# EAGLE design Daughter_Board (EAGLE 8.6.0)
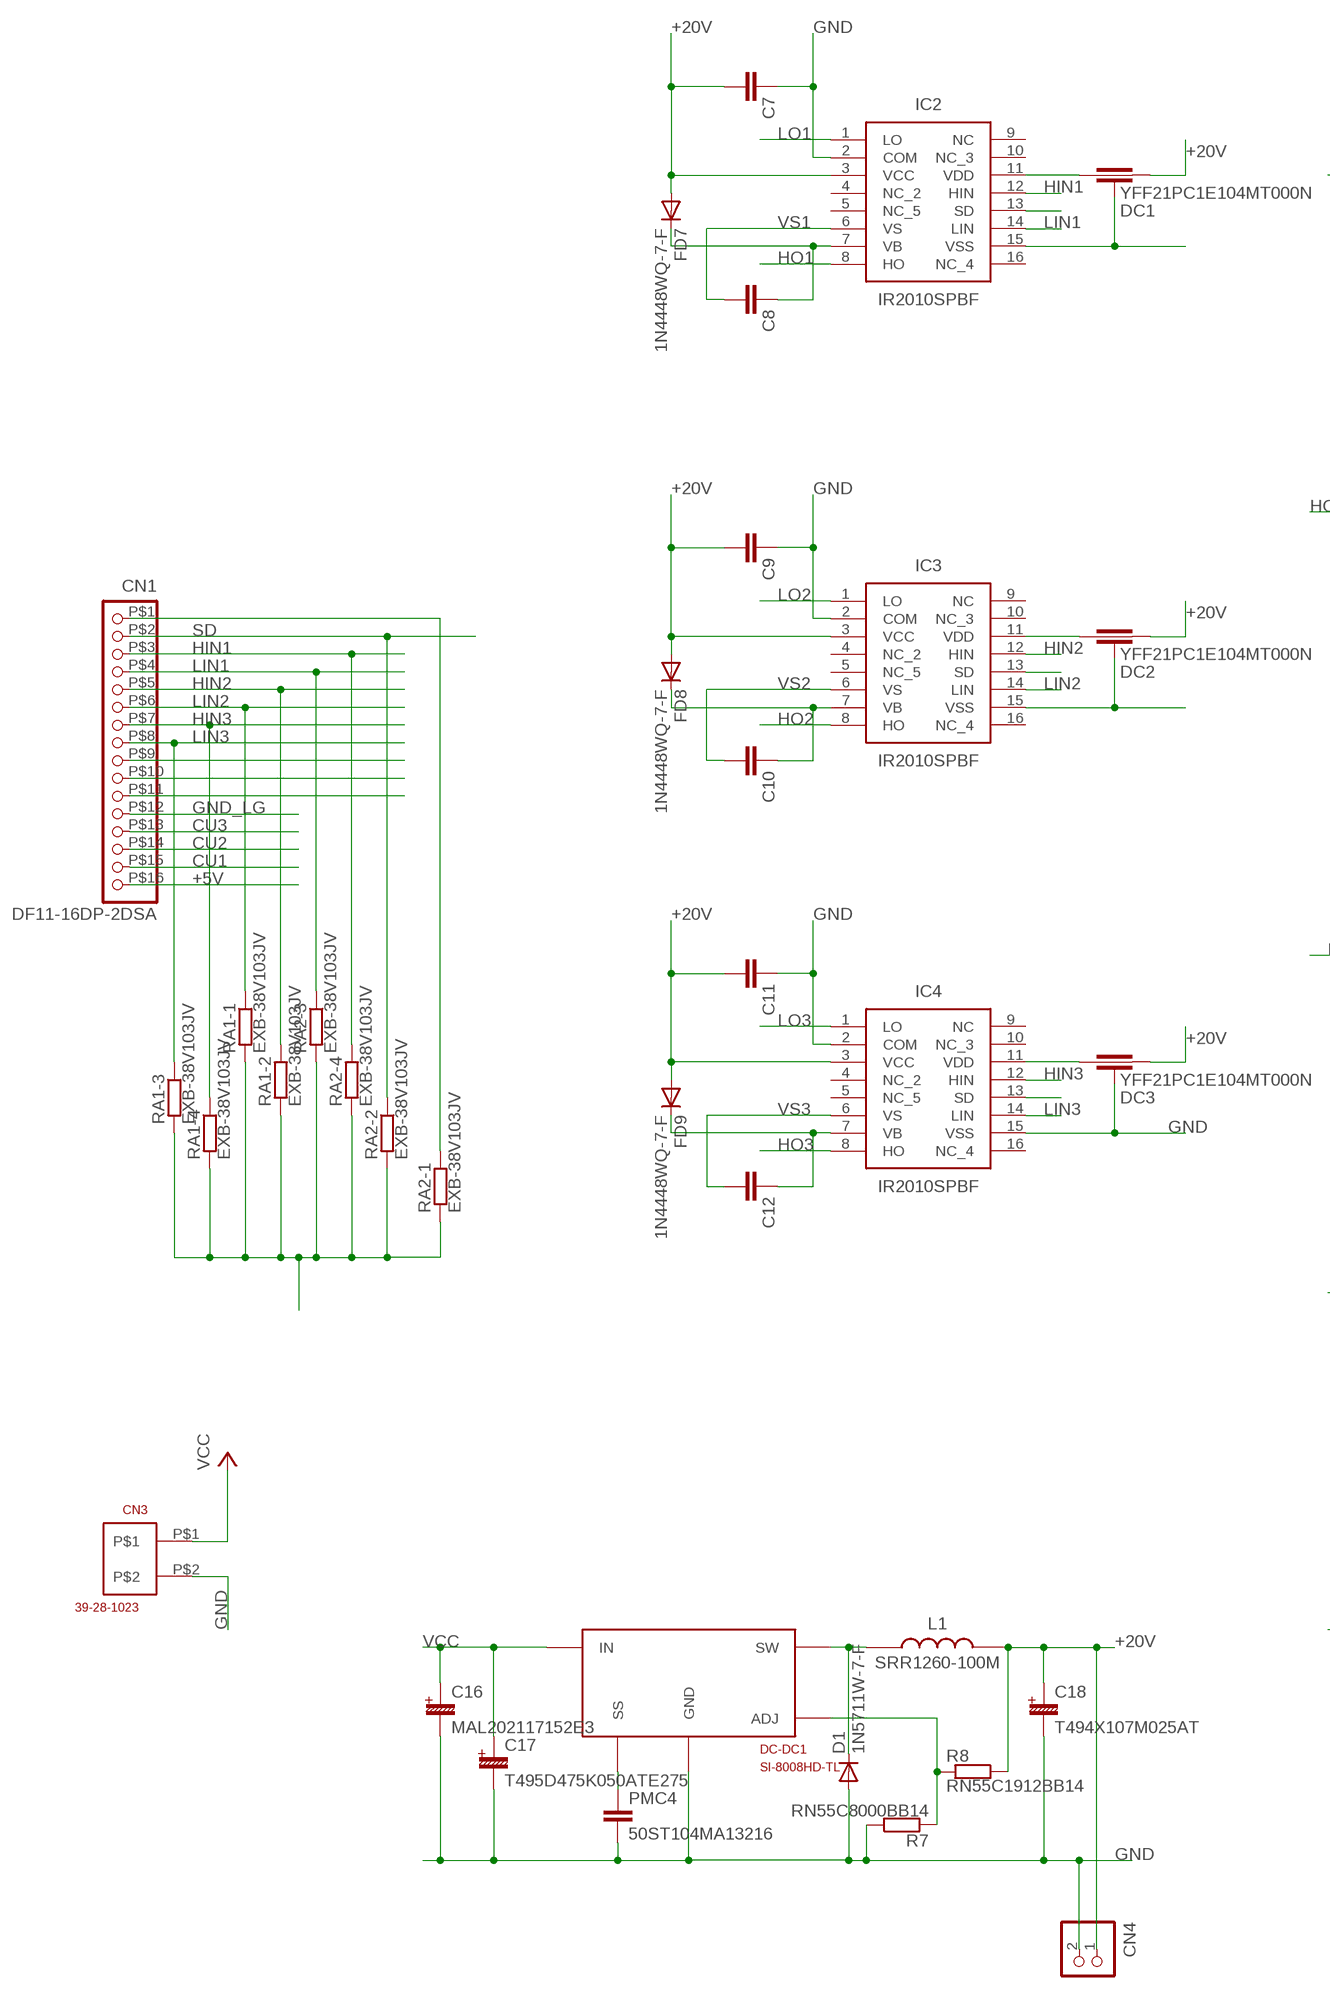
[diagram p0: schematic, sheet 1, part 1 of 3]
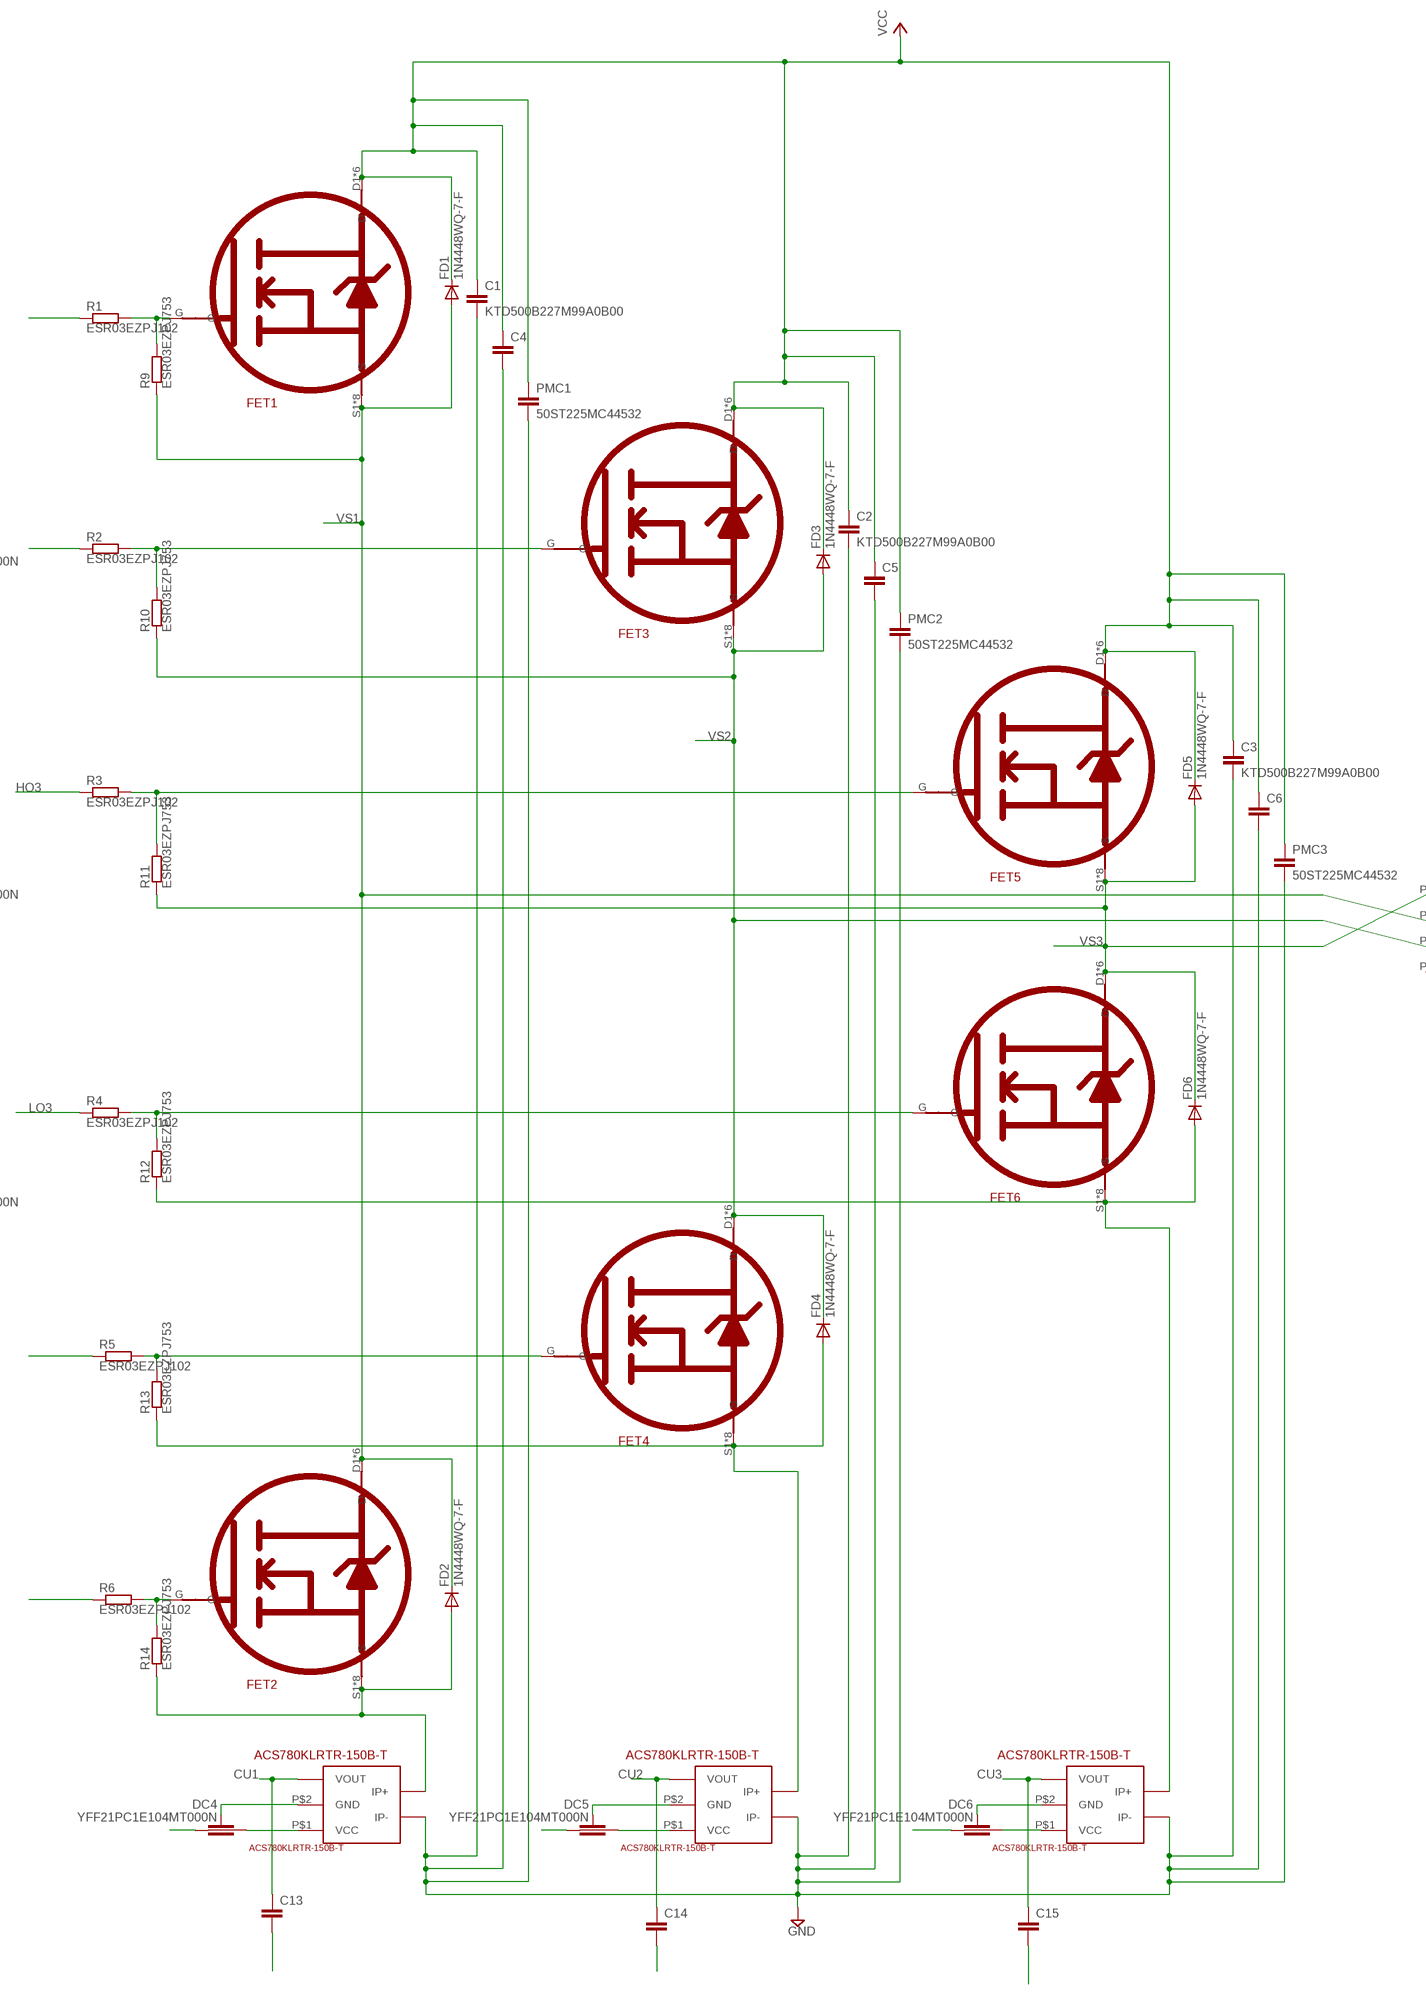
[diagram p1: schematic, sheet 1, part 2 of 3]
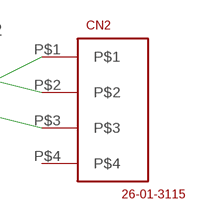
[diagram p2: schematic, sheet 1, part 3 of 3]

## Parts
C1  KTD500B227M99A0B00  [TKA50V_150U-220]
C2  KTD500B227M99A0B00  [TKA50V_150U-220]
C3  KTD500B227M99A0B00  [TKA50V_150U-220]
C4  CKG32KX7R1H105M335AJ  [CGK32K]
C5  CKG32KX7R1H105M335AJ  [CGK32K]
C6  CKG32KX7R1H105M335AJ  [CGK32K]
C7  C2012JB0J476M125AC  [C2012]
C8  C2012JB0J476M125AC  [C2012]
C9  C2012JB0J476M125AC  [C2012]
C10  C2012JB0J476M125AC  [C2012]
C11  C2012JB0J476M125AC  [C2012]
C12  C2012JB0J476M125AC  [C2012]
C13  CGA1A2C0G1E180J030BA  [CC0603]
C14  CGA1A2C0G1E180J030BA  [CC0603]
C15  CGA1A2C0G1E180J030BA  [CC0603]
C16  MAL202117152E3  [012AMS13*30]
C17  T495D475K050ATE275  [T495_D]
C18  T494X107M025AT  [T494_X]
CN1  DF11-16DP-2DSA  [DF11-16DP-2D]
CN2  26-01-3115  [26-01-3115]
CN3  39-28-1023  [39-28-1023]
CN4  B2B-XH-A  [B2B-XH-A]
D1  1N5711W-7-F  [SOD123]
DC1  YFF21PC1E104MT000N  [YFF21PC]
DC2  YFF21PC1E104MT000N  [YFF21PC]
DC3  YFF21PC1E104MT000N  [YFF21PC]
DC4  YFF21PC1E104MT000N  [YFF21PC]
DC5  YFF21PC1E104MT000N  [YFF21PC]
DC6  YFF21PC1E104MT000N  [YFF21PC]
DC-DC1  SI-8008HD-TL  [D2_PACAGE_5PIN]
FD1  1N4448WQ-7-F  [SOD123]
FD2  1N4448WQ-7-F  [SOD123]
FD3  1N4448WQ-7-F  [SOD123]
FD4  1N4448WQ-7-F  [SOD123]
FD5  1N4448WQ-7-F  [SOD123]
FD6  1N4448WQ-7-F  [SOD123]
FD7  1N4448WQ-7-F  [SOD123]
FD8  1N4448WQ-7-F  [SOD123]
FD9  1N4448WQ-7-F  [SOD123]
FET1  IRF7739L1TRPBF  [DIRECT_FET-L8]
FET2  IRF7739L1TRPBF  [DIRECT_FET-L8]
FET3  IRF7739L1TRPBF  [DIRECT_FET-L8]
FET4  IRF7739L1TRPBF  [DIRECT_FET-L8]
FET5  IRF7739L1TRPBF  [DIRECT_FET-L8]
FET6  IRF7739L1TRPBF  [DIRECT_FET-L8]
IC1  ACS780KLRTR-150B-T  [7-PIN_PSOP]
IC2  IR2010SPBF  [SOIC127P1032X265-16N]
IC3  IR2010SPBF  [SOIC127P1032X265-16N]
IC4  IR2010SPBF  [SOIC127P1032X265-16N]
IC5  ACS780KLRTR-150B-T  [7-PIN_PSOP]
IC6  ACS780KLRTR-150B-T  [7-PIN_PSOP]
L1  SRR1260-100M  [SRR1260]
PMC1  50ST225MC44532  [4532]
PMC2  50ST225MC44532  [4532]
PMC3  50ST225MC44532  [4532]
PMC4  50ST104MA13216  [3216]
R1  ESR03EZPJ102  [ESR03]
R2  ESR03EZPJ102  [ESR03]
R3  ESR03EZPJ102  [ESR03]
R4  ESR03EZPJ102  [ESR03]
R5  ESR03EZPJ102  [ESR03]
R6  ESR03EZPJ102  [ESR03]
R7  RN55C8000BB14  [CMF55]
R8  RN55C1912BB14  [CMF55]
R9  ESR03EZPJ753  [ESR03]
R10  ESR03EZPJ753  [ESR03]
R11  ESR03EZPJ753  [ESR03]
R12  ESR03EZPJ753  [ESR03]
R13  ESR03EZPJ753  [ESR03]
R14  ESR03EZPJ753  [ESR03]
RA1  EXB-38V103JV  [EXB-38V,28V]
RA2  EXB-38V103JV  [EXB-38V,28V]

## Nets
+5V: CN1.P$16 DC4.P$2 DC5.P$2 DC6.P$2
+20V: C7.P$2 C9.P$2 C11.P$2 C18.P$+(+) CN4.1 DC1.P$2 DC2.P$2 DC3.P$2 FD7.A FD8.A FD9.A IC2.3(VCC) IC3.3(VCC) IC4.3(VCC) L1.P$2 R8.P$1
CU1: C13.P$1 CN1.P$15 IC1.P$3(VOUT)
CU2: C14.P$1 CN1.P$14 IC5.P$3(VOUT)
CU3: C15.P$1 CN1.P$13 IC6.P$3(VOUT)
GND: C1.P$2 C2.P$2 C3.P$2 C4.P$2 C5.P$2 C6.P$2 C7.P$1 C9.P$1 C11.P$1 C16.P$2 C17.P$2 C18.P$2 CN3.P$2 CN4.2 D1.A DC1.GND1(GND) DC1.GND2(GND) DC2.GND1(GND) DC2.GND2(GND) DC3.GND1(GND) DC3.GND2(GND) DC-DC1.P$1(GND) DC-DC1.P$4(GND) IC1.P$6(IP-) IC2.2(COM) IC2.15(VSS) IC3.2(COM) IC3.15(VSS) IC4.2(COM) IC4.15(VSS) IC5.P$6(IP-) IC6.P$6(IP-) PMC1.P$2 PMC2.P$2 PMC3.P$2 PMC4.P$2 R7.P$1
GND_LG: C13.P$2 C14.P$2 C15.P$2 CN1.P$12 DC4.GND1(GND) DC4.GND2(GND) DC5.GND1(GND) DC5.GND2(GND) DC6.GND1(GND) DC6.GND2(GND) IC1.P$2(GND) IC5.P$2(GND) IC6.P$2(GND) RA1.P$5 RA1.P$6 RA1.P$7 RA1.P$8 RA2.P$5 RA2.P$6 RA2.P$7 RA2.P$8
HIN1: CN1.P$3 IC2.12(HIN) RA2.P$4
HIN2: CN1.P$5 IC3.12(HIN) RA1.P$2
HIN3: CN1.P$7 IC4.12(HIN) RA1.P$4
HO1: IC2.8(HO) R1.P$2
HO2: IC3.8(HO) R2.P$2
HO3: IC4.8(HO) R3.P$2
LIN1: CN1.P$4 IC2.14(LIN) RA2.P$3
LIN2: CN1.P$6 IC3.14(LIN) RA1.P$1
LIN3: CN1.P$8 IC4.14(LIN) RA1.P$3
LO1: IC2.1(LO) R6.P$2
LO2: IC3.1(LO) R5.P$2
LO3: IC4.1(LO) R4.P$2
N$1: CN1.P$1 RA2.P$1
N$3: FD2.A FET2.S1(S) FET2.S2(S) FET2.S3(S) FET2.S4(S) FET2.S5(S) FET2.S6(S) FET2.S7(S) FET2.S8(S) IC1.P$5(IP+) R14.P$2
N$5: FD4.A FET4.S1(S) FET4.S2(S) FET4.S3(S) FET4.S4(S) FET4.S5(S) FET4.S6(S) FET4.S7(S) FET4.S8(S) IC5.P$5(IP+) R13.P$2
N$7: DC4.P$1 IC1.P$1(VCC)
N$8: D1.K(C) DC-DC1.P$3(SW) L1.P$1
N$9: FET2.G R6.P$1 R14.P$1
N$10: DC5.P$1 IC5.P$1(VCC)
N$11: CN1.P$9
N$12: CN1.P$10
N$13: CN1.P$11
N$14: FET4.G R5.P$1 R13.P$1
N$15: FD6.A FET6.S1(S) FET6.S2(S) FET6.S3(S) FET6.S4(S) FET6.S5(S) FET6.S6(S) FET6.S7(S) FET6.S8(S) IC6.P$5(IP+) R12.P$2
N$16: DC6.P$1 IC6.P$1(VCC)
N$17: DC-DC1.P$5(ADJ) R7.P$2 R8.P$2
N$18: FET6.G R4.P$1 R12.P$1
N$19: FET5.G R3.P$1 R11.P$1
N$20: FET3.G R2.P$1 R10.P$1
N$21: FET1.G R1.P$1 R9.P$1
N$23: C8.P$1 FD7.K(C) IC2.7(VB)
N$25: C10.P$1 FD8.K(C) IC3.7(VB)
N$27: C12.P$1 FD9.K(C) IC4.7(VB)
N$28: DC2.P$1 IC3.11(VDD)
N$29: DC3.P$1 IC4.11(VDD)
N$30: DC1.P$1 IC2.11(VDD)
N$31: DC-DC1.P$6(SS) PMC4.P$1
SD: CN1.P$2 IC2.13(SD) IC3.13(SD) IC4.13(SD) RA2.P$2
VCC: C1.P$1 C2.P$1 C3.P$1 C4.P$1 C5.P$1 C6.P$1 C16.P$1(+) C17.P$1(+) CN3.P$1 DC-DC1.P$2(IN) FD1.K(C) FD3.K(C) FD5.K(C) FET1.D1(D) FET1.D2(D) FET1.D3(D) FET1.D4(D) FET1.D5(D) FET1.D6(D) FET3.D1(D) FET3.D2(D) FET3.D3(D) FET3.D4(D) FET3.D5(D) FET3.D6(D) FET5.D1(D) FET5.D2(D) FET5.D3(D) FET5.D4(D) FET5.D5(D) FET5.D6(D) PMC1.P$1 PMC2.P$1 PMC3.P$1
VS1: C8.P$2 CN2.P$2 FD1.A FD2.K(C) FET1.S1(S) FET1.S2(S) FET1.S3(S) FET1.S4(S) FET1.S5(S) FET1.S6(S) FET1.S7(S) FET1.S8(S) FET2.D1(D) FET2.D2(D) FET2.D3(D) FET2.D4(D) FET2.D5(D) FET2.D6(D) IC2.6(VS) R9.P$2
VS2: C10.P$2 CN2.P$3 FD3.A FD4.K(C) FET3.S1(S) FET3.S2(S) FET3.S3(S) FET3.S4(S) FET3.S5(S) FET3.S6(S) FET3.S7(S) FET3.S8(S) FET4.D1(D) FET4.D2(D) FET4.D3(D) FET4.D4(D) FET4.D5(D) FET4.D6(D) IC3.6(VS) R10.P$2
VS3: C12.P$2 CN2.P$1 FD5.A FD6.K(C) FET5.S1(S) FET5.S2(S) FET5.S3(S) FET5.S4(S) FET5.S5(S) FET5.S6(S) FET5.S7(S) FET5.S8(S) FET6.D1(D) FET6.D2(D) FET6.D3(D) FET6.D4(D) FET6.D5(D) FET6.D6(D) IC4.6(VS) R11.P$2
Unconnected: CN2.P$4 IC2.4(NC_2) IC2.5(NC_5) IC2.9(NC) IC2.10(NC_3) IC2.16(NC_4) IC3.4(NC_2) IC3.5(NC_5) IC3.9(NC) IC3.10(NC_3) IC3.16(NC_4) IC4.4(NC_2) IC4.5(NC_5) IC4.9(NC) IC4.10(NC_3) IC4.16(NC_4)

## Library data of the parts
C1-C3 = United_Chemi-con:KTD500B227M99A0B00
C4-C6 = TDK:CKG32KX7R1H105M335AJ: 1μ MLCC SMDリード付き
C7-C12 = TDK:C2012JB0J476M125AC: 47µF ±20% 6.3V セラミックコンデンサ JB 0805
C13-C15 = TDK:CGA1A2C0G1E180J030BA: 18pF ±5% 25V セラミックコンデンサ C0G、NP0 0201（0603メートル法）
C16 = VISHAY:MAL202117152E3: アルミ電解コンデンサ 1500µF 40V アキシャル、CAN 8000時間 @ 85°C 159ミリオーム
C17 = KEMET:T495D475K050ATE275: 4.7µF 成形 タンタルコンデンサ 50V 2917（7343メートル法）
C18 = KEMET:T494X107M025AT: 100µF 成形 タンタルコンデンサ 25V 2917（7343メートル法） 250ミリオーム
CN1 = Hirose:DF11-16DP-2DSA
CN2 = Molex:26-01-3115
CN3 = Molex:39-28-1023
CN4 = jst-xh:B2B-XH-A: Wire-to-Board 2.5mm pitch top mount connector Source: http://www.jst-mfg.com/product/pdf/jpn/XH.pdf http://www.jst-mfg.com/product/detail.php?series=277
D1 = DIODE:1N5711W-7-F: RF Diode Schottky - Single 70V 15mA 333mW SOD-123
DC1-DC6 = TDK:YFF21PC1E104MT000N: 0.1µF Feed Through Capacitor 25V 2A 80 mOhm 0805 (2012 Metric), 4 PC Pad
DC-DC1 = SANKEN:SI-8008HD-TL
FD1-FD9 = DIODE:1N4448WQ-7-F: ダイオード 標準 75V 250mA 面実装 SOD-123
FET1-FET6 = Infinion:IRF7739L1TRPBF
IC1 IC5 IC6 = ACS780:ACS780KLRTR-150B-T
IC2-IC4 = IR2010SPBF:IR2010SPBF: International Rectifier IR2010SPBF, Dual MOSFET Power Driver, 3A, 3.3 20 V, Non-Inverting, 16-Pin SOIC <http://uk.rs-online.com/largeimages/SOICW-16.jpg> Source: Datasheet; DESCRIPTION: International Rectifier IR2010SPBF, Dual MOSFET Power Driver, 3A, 3.3 20 V, Non-Inverting, 16-Pin SOIC; HEIGHT: mm; MANUFACTURER_NAME: International Rectifier; MANUFACTURER_PART_NUMBER: IR2010SPBF; RS_PART_NUMBER: 2509056226; SUPPLIER_NAME: RS
L1 = Bourns:SRR1260-100M: 10µH シールド付き 巻線 インダクタ 5.5A 20ミリオーム最大 非標準
PMC1-PMC3 = Rubycon:50ST225MC44532
PMC4 = Rubycon:50ST104MA13216: 0.1µF フィルムコンデンサ 50V アクリル、金属皮膜 1206（3216メートル法）
R1-R6 = ROHM:ESR03EZPJ102: 1 kOhms ±5% 0.25W、1/4W チップ抵抗 0603（1608メートル法） 車載用AEC-Q200、パルス耐性 厚膜
R7 = VISHAY:RN55C8000BB14: 金属被膜抵抗器 - スルーホール 1/10watt 800ohms .1% 50ppm
R8 = VISHAY:RN55C1912BB14: 金属被膜抵抗器 - スルーホール 1/10watt 19.1Kohms .1% 50ppm
R9-R14 = ROHM:ESR03EZPJ753: 75 kOhms ±5% 0.25W、1/4W チップ抵抗 0603（1608メートル法） 車載用AEC-Q200、パルス耐性 厚膜
RA1 RA2 = Pana_Chip_RA:EXB-38V103JV

## Board
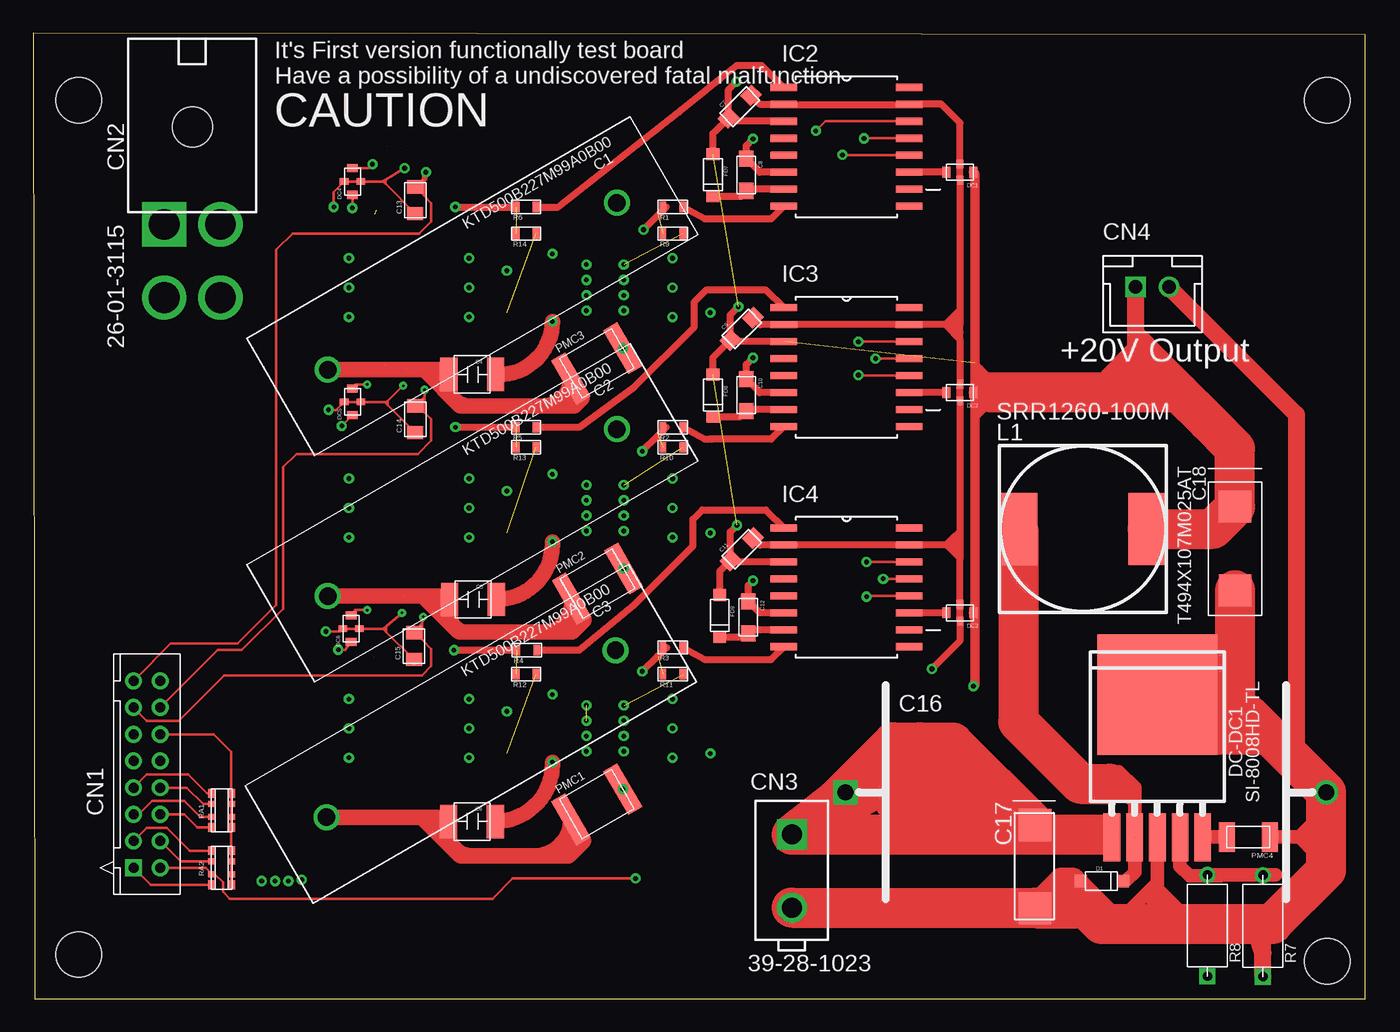
[diagram p3: board, top side]
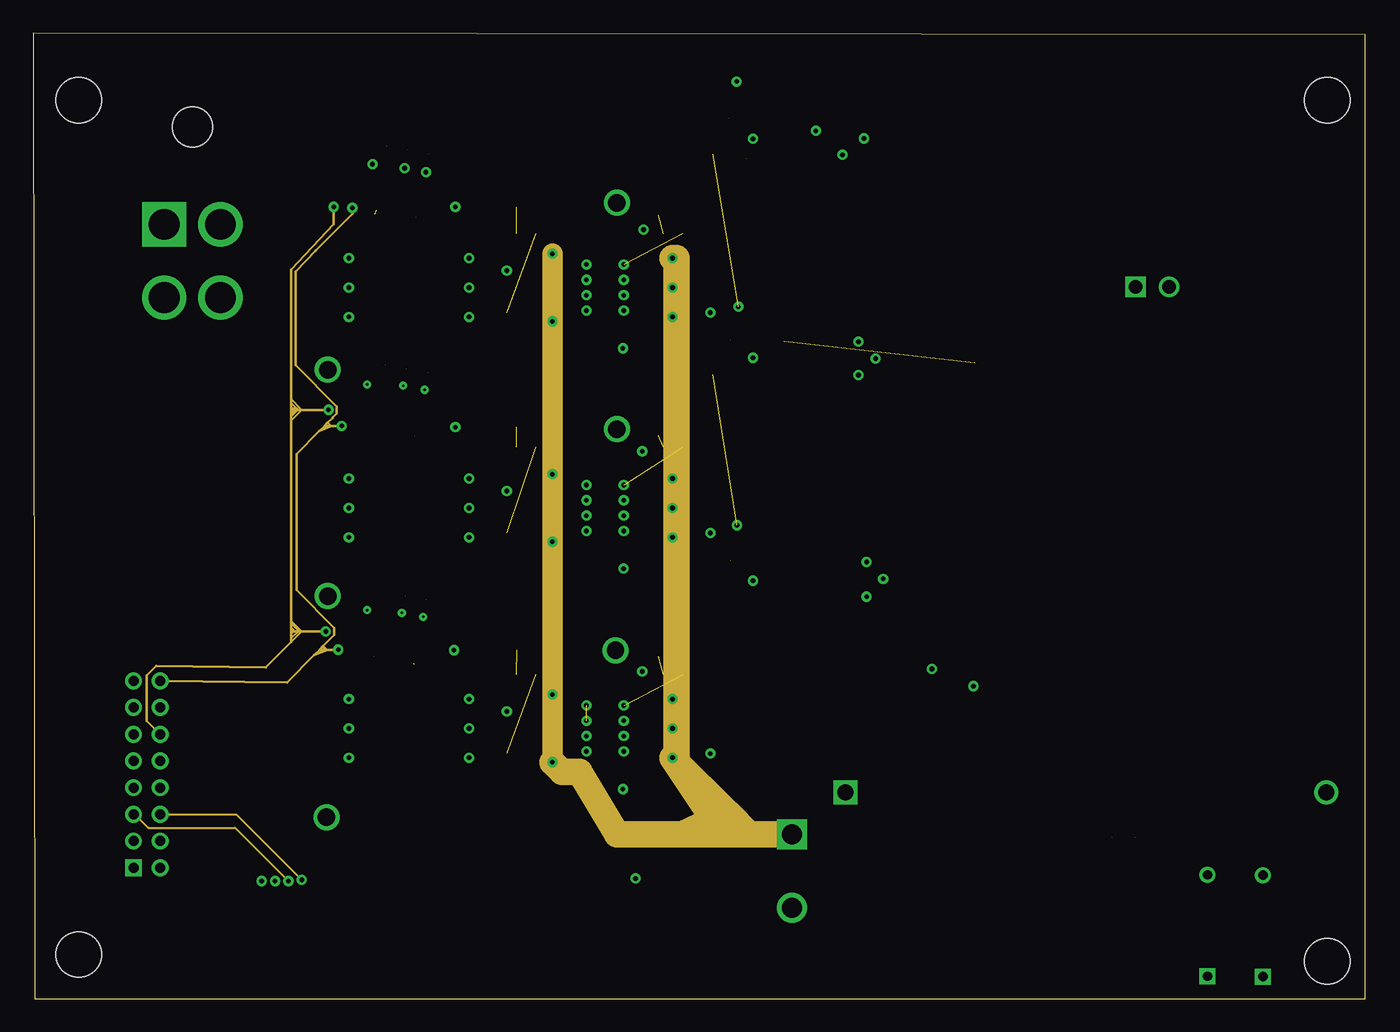
[diagram p4: board, inner layer Route2]
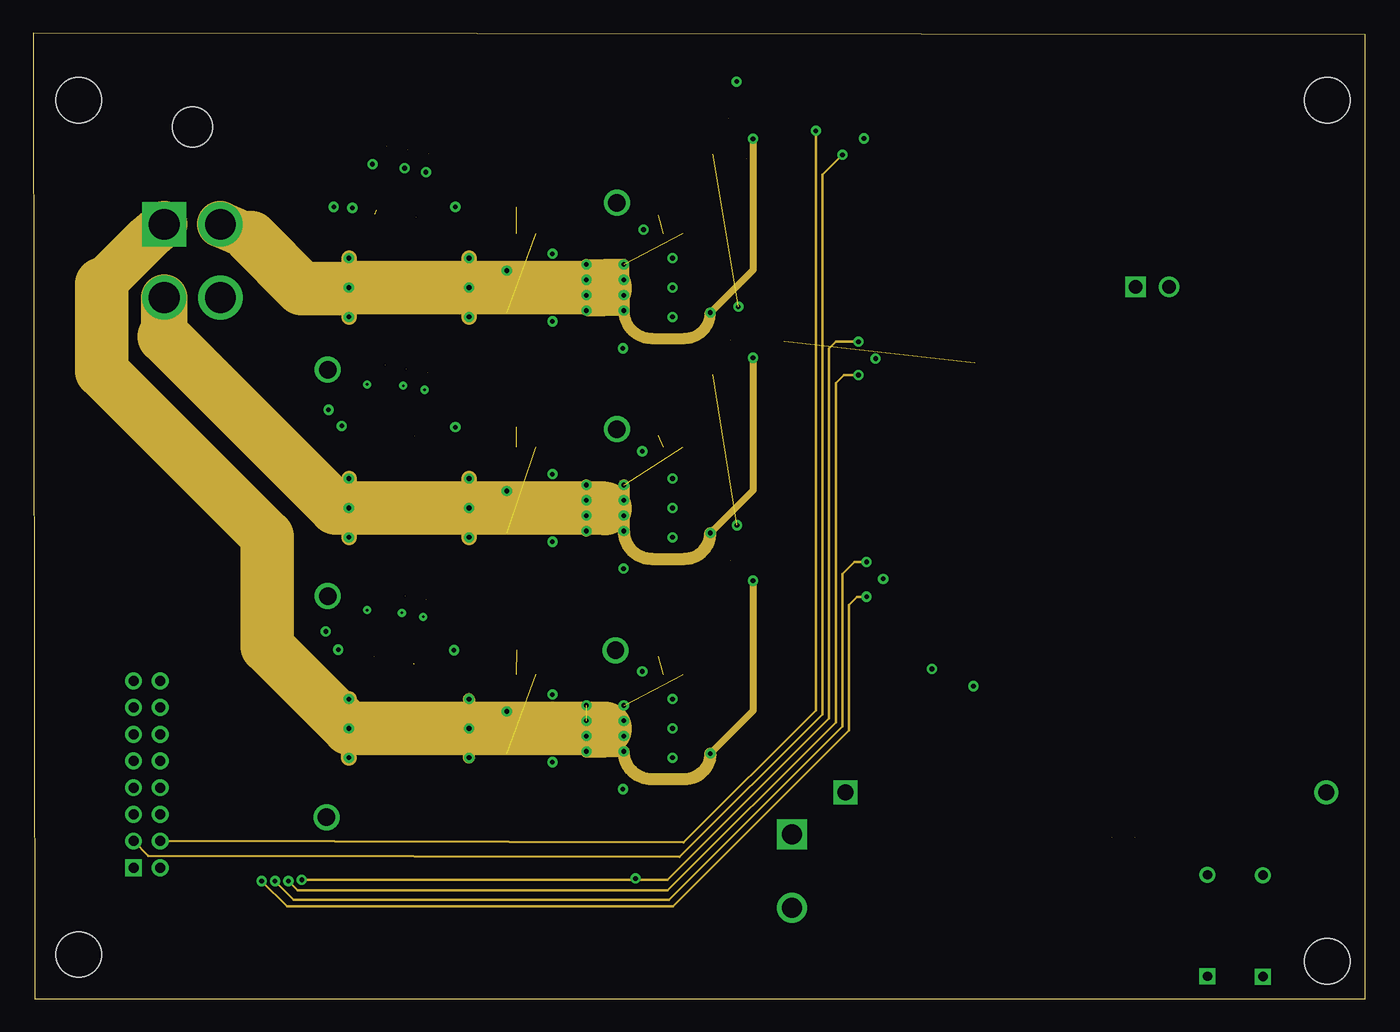
[diagram p5: board, inner layer Route3]
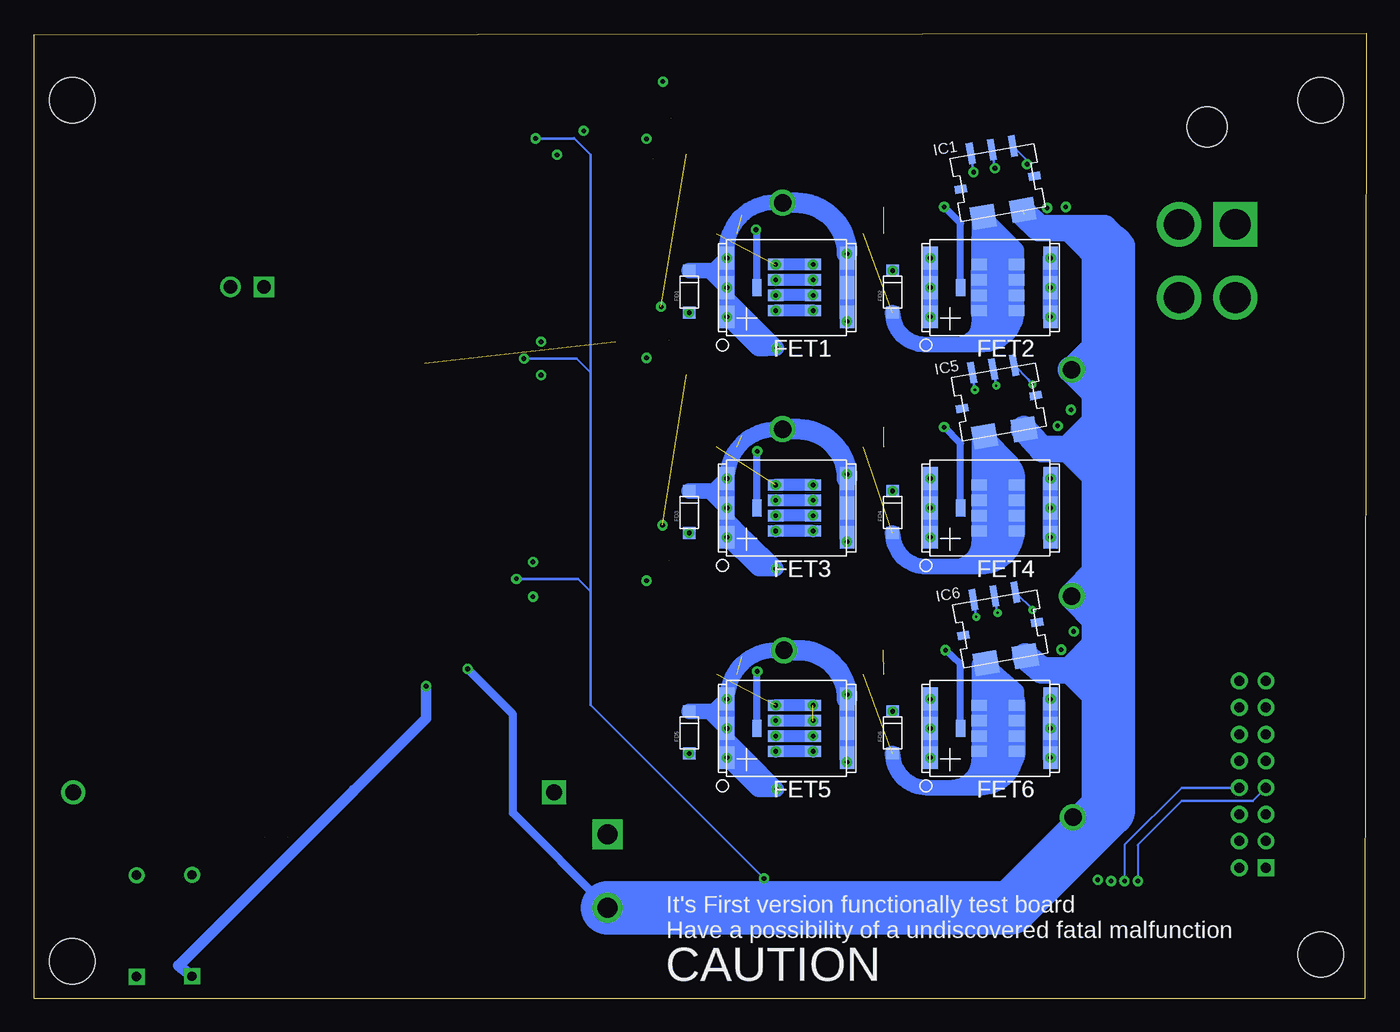
[diagram p6: board, bottom side, seen from below]

Size 99.75 x 72.3 mm. Coordinates in mm from the lower left corner, seen from the top.
Outline: 0.1,0 99.75,0 99.75,72.2 0,72.3 0.1,0
Copper layers (1*2+3*16): Top 0.035mm / dielectric 1.5mm / Route2 0.035mm / dielectric 0.15mm / Route3 0.035mm / dielectric 0.2mm / Bottom 0.035mm
Design rules "default *": minimum track width 6mil, minimum drill 0.35mm, track to track 6mil, track to pad 6mil, pad to pad 6mil, via to via 6mil, smd to smd 6mil, copper to edge 40mil, drill to drill 6mil, minimum pad ring 10mil, minimum via ring 8mil, stop-mask expansion 4mil, vias tented up to drill 0mil, thermal gap 10mil
Holes 3.4 mm at 3.4,3.3 3.4,67.3 96.9,67.3 96.9,2.8

### Footprints (pad centres in the part's own frame; a part is rotated, then mirrored left to right if it is on the bottom)
TKA50V_150U-220 = drill 1.3: P$1 0,0; P$2 25,0
CGK32K = smd 1.3 x 2.5: P$1 0,0; P$2 3.5,0
C2012 = smd 1.2 x 1.1: P$1 0,0; P$2 2.4,0
CC0603 = smd 1 x 1.2: P$1 0,0; P$2 2,0
012AMS13*30 = drill 1.2 square: P$1 0,0 | drill 1.2: P$2 36,0
T495_D = smd 2.37 x 2.43: P$1 0,0; P$2 6.24,0
T494_X = smd 2.37 x 2.43: P$2 3.12,0; P$+ -3.12,0
DF11-16DP-2D = drill 0.75 square: P$1 0,0 | drill 0.75: P$2 0,2; P$3 -2,0; P$4 -2,2; P$5 -4,0; P$6 -4,2; P$7 -6,0; P$8 -6,2; P$9 -8,0; P$10 -8,2; P$11 -10,0; P$12 -10,2; P$13 -12,0; P$14 -12,2; P$15 -14,0; P$16 -14,2
26-01-3115 = drill 2.3 square: P$1 2.1,0 | drill 2.3: P$2 -2.1,0; P$3 2.1,5.5; P$4 -2.1,5.5 | hole 3: 0,-7.3
39-28-1023 = drill 1.5 square: P$1 0,0 | drill 1.5: P$2 0,-5.5
B2B-XH-A = drill 1.016 square: 1 -1.25,0 | drill 1.016: 2 1.25,0
SOD123 = smd 0.9 x 0.95: A 3.15,0; K 0,0
YFF21PC = smd 0.5 x 0.65: GND1 0,0.625; GND2 0,-0.625 | smd 0.6 x 0.8: P$1 -1,0; P$2 1,0
D2_PACAGE_5PIN = smd 9 x 9: P$1 0,3 | smd 1.25 x 3.6: P$2 -3.4,-7.7; P$3 -1.7,-7.7; P$4 0,-7.7; P$5 1.7,-7.7; P$6 3.4,-7.7
DIRECT_FET-L8 = smd 1.1 x 1.7: D1 -2.25,2.2; D2 -2.25,0; D3 -2.25,-2.2; D4 6.75,-2.2; D5 6.75,0; D6 6.75,2.2 | smd 0.7 x 1.3: G 0,0 | smd 1.18 x 0.85: S1 1.4,1.725; S2 1.4,0.575; S3 1.4,-0.575; S4 1.4,-1.725; S5 4.2,1.725; S6 4.2,0.575; S7 4.2,-0.575; S8 4.2,-1.725
7-PIN_PSOP = smd 0.5 x 1.6: P$1 -1.6,-2.5; P$2 0,-2.5; P$3 1.6,-2.5 | smd 0.9 x 0.6: P$4 2.8,0; P$7 -2.8,0 | smd 1.8 x 1.7: P$5 1.5,2.35; P$6 -1.5,2.35
SOIC127P1032X265-16N = smd 1.981 x 0.533: 1 -4.699,4.445; 2 -4.699,3.175; 3 -4.699,1.905; 4 -4.699,0.635; 5 -4.699,-0.635; 6 -4.699,-1.905; 7 -4.699,-3.175; 8 -4.699,-4.445; 9 4.699,-4.445; 10 4.699,-3.175; 11 4.699,-1.905; 12 4.699,-0.635; 13 4.699,0.635; 14 4.699,1.905; 15 4.699,3.175; 16 4.699,4.445
SRR1260 = smd 2.9 x 5.4: P$1 -4.85,0; P$2 4.85,0
4532 = smd 1.2 x 3.8: P$1 0,0; P$2 4.5,0
3216 = smd 1.2 x 2.2: P$1 0,0; P$2 3.2,0
ESR03 = smd 0.5 x 0.8: P$1 -0.75,0; P$2 0.75,0
CMF55 = drill 0.7 square: P$1 -3.8,0 | drill 0.7: P$2 3.8,0
EXB-38V,28V = smd 0.65 x 0.55: P$1 -1.275,0.725; P$4 1.275,0.725; P$5 1.275,-0.725; P$8 -1.275,-0.725 | smd 0.45 x 0.55: P$2 -0.475,0.725; P$3 0.475,0.725; P$6 0.475,-0.725; P$7 -0.475,-0.725

### Placement (x,y rotation side)
C1  43.7,59.61 210 top
C2  43.7,42.65 210 top
C3  43.6,26.09 210 top
C4  34.62,46.75 180 top
C5  34.67,29.9 180 top
C6  34.6,13.27 180 top
C7  53.75,67.65 225 top
C8  53.4,60.5 90 top
C9  53.9,51.01 225 top
C10  53.4,44.01 90 top
C11  53.9,34.51 225 top
C12  53.55,27.36 90 top
C13  28.6,60.8 270 top
C14  28.6,44.4 270 top
C15  28.5,27.4 270 top
C16  60.82,15.46 0 top
C17  75.03,13.02 270 top
C18  90,33.71 270 top
CN1  7.5,9.8 270 top
CN2  11.9,58 180 top
CN3  56.8,12.3 0 top
CN4  83.8,53.3 0 top
D1  81.6,8.8 180 top
DC1  69.4,61.9 0 top
DC2  69.4,45.4 0 top
DC3  69.4,28.9 0 top
DC4  23.9,61.2 270 top
DC5  23.9,44.7 270 top
DC6  23.8,27.7 270 top
DC-DC1  84.18,19.77 0 top
FD1  50.7,54.53 270 bottom
FD2  35.46,54.53 270 bottom
FD3  50.7,38.02 270 bottom
FD4  35.46,38.02 270 bottom
FD5  50.7,21.51 270 bottom
FD6  35.46,21.51 270 bottom
FD7  50.9,60.1 90 top
FD8  50.9,43.6 90 top
FD9  51.4,27.1 90 top
FET1  45.62,53.26 0 bottom
FET2  30.38,53.26 0 bottom
FET3  45.62,36.75 0 bottom
FET4  30.38,36.75 0 bottom
FET5  45.62,20.24 0 bottom
FET6  30.38,20.24 0 bottom
IC1  27.6,61.12 190 bottom
IC2  60.9,63.8 0 top
IC3  60.9,47.3 0 top
IC4  60.9,30.8 0 top
IC5  27.5,44.7 190 bottom
IC6  27.4,27.7 190 bottom
L1  78.61,35.18 0 top
PMC1  44.15,15.69 210 top
PMC2  44.2,32.21 210 top
PMC3  44.15,48.71 210 top
PMC4  89.4,12.1 0 top
R1  47.9,59.3 0 top
R2  47.9,42.8 0 top
R3  47.9,26.3 0 top
R4  36.95,26.1 0 top
R5  36.9,42.8 0 top
R6  36.9,59.3 0 top
R7  92.09,5.44 90 top
R8  87.94,5.47 90 top
R9  47.9,57.3 0 top
R10  47.9,41.3 0 top
R11  47.9,24.3 0 top
R12  36.9,24.3 0 top
R13  36.9,41.3 0 top
R14  36.9,57.3 0 top
RA1  14.1,14.1 90 top
RA2  14.1,9.8 90 top

### Tracks (layer width: path | path; a pad name or v marks a point on that pad's centre or on a via)
+5V  (via drill 0.35)
  Top 0.2: DC4.P$2 v23.89,59.23 | DC5.P$2 v23.1,42.9 | DC6.P$2 23.33,26.13 v22.83,26.13
  Route2 0.2: v23.89,59.23 23.89,58.79 21.13,56.03 19.65,54.46 19.65,47.44 22.73,44.36 22.73,43.84 22.4,43.51 22.4,43.5 22.05,43.15 | 22.05,43.15 21.8,42.9 | 21.8,42.9 21.4,42.5 | 21.4,42.5 19.7,40.8 19.7,30.59 22.53,27.76 22.53,27.24 21.7,26.4 | v23.1,42.9 22.3,42.9 | 22.3,42.9 21.8,42.9 | 22.3,42.9 22.05,43.15 | 22.3,42.9 21.4,42.5 | 21.7,26.4 21.42,26.13 | 21.42,26.13 21.05,25.75 | 21.05,25.75 18.99,23.7 CN1.P$16 | v22.83,26.13 22,26.13 | 22,26.13 21.8,26.13 | 21.8,26.13 21.42,26.13 | 21.8,26.13 21.7,26.4 | 22,26.13 21.05,25.75 | 22,26.13 21.7,26.4
+20V  (via drill 0.35)  (6 unrouted)
  Top 0.508: 70.5,47.6 70.9,47.2 | 70.9,47.2 71.7,46.4 71.7,45.4 | 70.5,43.5 71.7,44.7 71.7,45.4 | 70.9,47.2 70.9,46.2 71.7,45.4 | IC3.3 52.31,49.2 C9.P$2 | FD8.A 50.9,48.01 C9.P$2 | IC4.3 52.31,32.7 C11.P$2 | C11.P$2 51.4,32.01 FD9.A | FD7.A 50.9,64.8 C7.P$2 | IC2.3 52.31,65.7 C7.P$2 | C9.P$2 52.2,51.22 v52.8,51.82 | C7.P$2 52.06,68.08 v52.67,68.69 | C11.P$2 52.2,34.96 v52.7,35.46
  Top 0.7: DC2.P$2 70.5,45.3 | 70.5,29 DC3.P$2 70.5,28.8 | 70.5,45.3 70.5,43.5 70.5,29 | v70.4,23.4 70.5,23.5 70.5,28.8 | 70.5,29 70.5,28.8 | DC1.P$2 70.5,61.8 70.5,47.6 70.5,45.3
  Top 1.27: CN4.1 82.55,49.85 | 82.55,49.85 83.45,48.95 | 83.45,48.95 84.05,48.35 | 84.05,48.35 87.2,45.2 87.2,43.1 88,42.3 88,43.2 87.95,43.25 | 85.8,45.4 84.05,47.15 84.05,48.35 | 83.3,45.4 83.3,48.8 83.45,48.95 | 82.55,49.85 82.55,48.7 | 82.55,48.7 82.55,46.95 | 82.55,46.95 82.55,46.25 82.4,46.1 | 82.55,48.7 79.9,46.05 79.9,46 | 81,45.4 82.55,46.95
  Top 3: 71.7,45.4 81,45.4 83.3,45.4 85.8,45.4 87.95,43.25 90,41.2 C18.P$+ 88.35,35.18 L1.P$2
  Bottom 0.8: 75.8,15.6 70.4,21 v70.4,23.4
  Bottom 0.813: R8.P$1 88.94,2.46 75.8,15.6
CU1  (via drill 0.35)  (1 unrouted)
  Top 0.15: 7.55,23.85 9,25.3 | 13.8,26.6 13.7,26.6
  Top 0.152: CN1.P$15 7.55,23.85 | 13.8,26.6 10.3,26.6
  Top 0.2: 29.25,60.15 C13.P$1 29.2,61.4 | 29.25,60.15 29.8,59.6 29.8,58.2 28.9,57.3 19.4,57.3 18.2,56.1 18.2,29.5 15.3,26.6 13.8,26.6 | 29.25,61.2 29.25,61.4 29.2,61.4 | 29.25,61.2 29.25,60.15 | 29.2,61.4 29.2,61.7 v29.4,61.9 29.4,61.35 29.25,61.2 | 13.7,26.6 10.3,26.6 7.55,23.85
  Bottom 0.2: 29.7,63.22 IC1.P$3 v29.4,61.9
CU2  (via drill 0.2 pad 0.55)  (1 unrouted)
  Top 0.2: v29.3,45.6 29.3,45.1 | 29.3,45.1 C14.P$1 | 29.3,45.1 29.3,43.9 29.8,43.4 29.8,41.8 28.8,40.8 19.7,40.8 18.7,39.8 18.7,29.2 15.6,26.1 13.8,26.1 CN1.P$14
  Bottom 0.2: 29.5,46.89 IC5.P$3 v29.3,45.6
CU3  (via drill 0.2)  (1 unrouted)
  Top 0.2: v29.2,28.6 29.1,28.1 | 29.1,28.1 C15.P$1 28.6,27.4 29.1,26.9 | 29.1,26.9 29.8,26.2 29.8,24.9 29.1,24.2 14.3,24.2 10.9,20.8 8.5,20.8 CN1.P$13 | 29.1,28.1 29.1,26.9
  Bottom 0.2: IC6.P$3 v29.2,28.6
GND  (via drill 0.35)  (2 unrouted)
  Top 0.508: 69.4,33 DC3.GND1 DC3.GND2 69.4,26.8 v67.3,24.7 | 69.4,33 68.7,33.7 | 68.7,33.7 68.4,34 | 68.4,34 68.38,33.97 | 68.38,33.97 IC4.15 IC4.2 54.43,33.97 C11.P$1 | 69.4,35 69.4,34.3 | 69.4,34.3 69.4,34 | 69.4,34 69.4,33.7 | 69.4,33.7 69.4,33 | 68.38,33.97 arc-90 68.4,34 | 68.4,34 69.4,34 | 69.4,33.7 68.7,33.7 | 68.4,34 68.85,34.45 | 68.85,34.45 69.4,35 | 69.4,34.3 69.25,34.45 68.85,34.45 | 69.4,49.38 69.4,49.9 | 69.4,49.9 69.4,50.5 | 68.9,50.47 69.38,50.47 69.4,50.5 | 68.9,50.47 68.3,50.47 | 69.4,51.57 DC1.GND2 DC1.GND1 69.4,65.6 68,67 65.62,67 IC2.15 IC2.2 54.43,66.97 C7.P$1 | 69.4,51.57 69.4,50.5 | 68.3,50.47 68.96,51.14 | 68.96,51.14 69.4,51.57 | 68.3,50.47 69.4,49.38 | 69.4,49.9 68.96,50.34 | 68.96,50.34 68.9,50.4 68.9,50.47 | 68.96,50.34 68.96,51.14 | 69.4,49.38 DC2.GND1 DC2.GND2 69.4,35 | 68.3,50.47 IC3.15 IC3.2 54.43,50.47 C9.P$1
  Top 0.8: 77.6,8 77.65,8 D1.A 78.43,8.82 77.02,8.82
  Top 1.016: 84.24,12 DC-DC1.P$4 84.18,8.68 | 83.35,7.85 82.3,6.8 | 84.7,5.6 84.7,6.5 84.18,7.02 | 84.18,7.02 83.35,7.85 | PMC4.P$2 94.8,12.1 | 94.8,12.1 96.82,12.1 | 94.8,12.1 96.1,10.8 | 94.8,12.1 96,13.3 | 84.18,8.68 84.18,7.02 | 83.35,7.85 83.95,8.45 | 83.95,8.45 84.18,8.68 | 83.95,8.45 85.9,6.5 86.4,6.5
  Top 1.143: 32.45,27.45 38.24,27.45 | 32.8,10.7 37.51,10.7 | 37.51,10.7 40.1,10.7 40.5,11.1 | PMC3.P$2 arc-90 38.19,44.4 | 38.19,44.4 32.5,44.4 | 32.5,44.4 arc-90 31.02,46.28 C4.P$2 arc90 30.56,47.11 29.3,47.11 | 29.3,47.11 C1.P$2 | 32.5,44.4 32.01,44.4 29.3,47.11 | 41.1,45 40.5,44.4 38.19,44.4 | C2.P$2 29.2,30.15 | 29.2,30.15 30.92,30.15 C5.P$2 | C5.P$2 31.12,29.23 | PMC2.P$2 40.3,29.51 arc-90 38.24,27.45 | 38.24,27.45 40.35,27.45 41.25,28.35 | 32.45,27.45 arc-90 31.17,28.73 C5.P$2 | 32.45,27.45 31.9,27.45 29.2,30.15 | 37.51,10.7 arc90 PMC1.P$2 40.25,11.35 40.5,11.1 | 40.5,11.1 41.2,11.8 | C3.P$2 29.1,13.59 | 29.1,13.59 30.78,13.59 C6.P$2 31.1,12.4 arc90 32.8,10.7 | 32.8,10.7 31.99,10.7 29.1,13.59
  Top 1.27: CN4.2 94.6,43.75 94.6,17.68 C16.P$2 | R7.P$1 92.09,3.4 | 92.09,3.4 92.09,5.31 92.8,5.6 | 92.09,3.4 91.59,4.9 91.4,4.9 91.4,5 90.8,5.6
  Top 2: 75.01,6.8 77.02,8.82 77.83,8.82 81.05,5.6 82.7,5.6
  Top 3: CN3.P$2 75.01,6.8 C17.P$2 78.82,6.78 80,5.6 82.7,5.6 84.7,5.6 90.8,5.6 92.8,5.6 96.82,9.62 96.82,12.1 C16.P$2 92.49,19.79 | 87.3,24.8 87.2,24.8 | 90,22.1 87.3,24.8 | 92.49,19.79 91.08,21.2 90.9,21.2 90,22.1 | C18.P$2 90,22.1 | 87.3,24.8 85.27,22.77 DC-DC1.P$1 87.16,19.79 92.49,19.79
  Bottom 0.61: CN3.P$2 63.9,13.9 63.9,21.3 v67.3,24.7
  Bottom 1.143: 19.3,44.3 19.75,44.3 22.9,41.15 22.85,41.15 20.1,38.4 | C3.P$2 19.81,13.59 arc-90 19.3,14.1 | C3.P$2 20.96,12.6 19.4,12.6 | C3.P$2 19.3,16.24 19.3,17.3
  Bottom 2: 19.3,55.7 19.3,56.08 20.92,57.7 | 19.3,49.8 21.99,47.11 C1.P$2 22.11,47.11 19.3,44.3 | 22.2,57.7 20.92,57.7 | 20.92,57.7 19.6,57.7 18.3,56.4 | 22.2,57.7 19.3,54.8 19.3,53.6 | 25.6,58.77 24.53,57.7 22.2,57.7 | C2.P$2 19.55,30.15 19.3,29.9 | C2.P$2 20,32.2 19.9,32.2 | C2.P$2 20,28.1 20,26.8 22.2,24.6 | IC5.P$6 24.3,41.15 22.9,41.15 19.3,41.15 | IC6.P$6 24.28,24.6 22.2,24.6 | 22.2,24.6 19.3,24.6 | 22.2,24.6 20.4,22.8 19.8,22.8
  Bottom 4: 19.3,56.08 19.3,53.6 19.3,49.8 19.3,44.3 19.3,41.15 19.3,29.9 19.3,24.6 19.3,17.3 19.3,14.1 26.6,6.8 CN3.P$2
GND_LG  (via drill 0.2, 0.35)  (3 unrouted)
  Top 0.2: v27.8,62.2 26.37,61.36 | 26.37,61.36 26.29,61.31 26.1,61.2 | 26.1,61.2 DC4.GND1 DC4.GND2 22.5,60.42 v22.5,59.3 | v22.1,44.1 22.67,44.1 DC5.GND2 DC5.GND1 26.3,44.7 | 26.2,27.7 DC6.GND1 DC6.GND2 22.97,27.5 v21.9,27.5 | 26.2,27.7 26.42,27.89 | 26.42,27.89 v27.6,28.9 | C15.P$2 26.42,27.48 | 26.42,27.48 26.2,27.7 | C14.P$2 26.55,44.45 | 26.55,44.45 26.3,44.7 | v27.7,45.91 26.55,44.75 | 26.55,44.75 26.49,44.7 26.3,44.7 | 26.55,44.75 26.55,44.45 | 26.42,27.89 26.42,27.48 | C13.P$2 26.37,61.03 | 26.37,61.03 26.2,61.2 26.1,61.2 | 26.37,61.03 26.37,61.36 | RA2.P$8 RA2.P$7 RA2.P$6 RA2.P$5 RA1.P$8 RA1.P$7 RA1.P$6 RA1.P$5 14.83,18.48 13.5,19.8 CN1.P$12
  Route2 0.2: v22.5,59.3 22.5,58 19.3,54.6 19.3,44.9 | 19.3,44.9 19.3,44.6 | 19.3,44.6 19.3,44.3 | 19.3,44.3 19.3,44.1 | 19.3,44.1 19.3,43.8 | 19.3,43.8 19.3,43.6 | 19.3,43.6 19.3,43.3 | 19.3,43.3 19.3,28.3 | 19.3,28.3 19.3,28.1 | 19.3,28.1 19.3,27.8 | 19.3,27.8 19.3,27.5 | 19.3,27.5 19.3,27.3 | 19.3,27.3 19.3,27 | 19.3,27 19.3,26.7 | v22.1,44.1 20.1,44.1 | 20.1,44.1 19.3,43.3 | 19.6,44.1 19.3,44.1 | 20.1,44.1 19.3,44.9 | 20.1,44.1 19.8,44.1 | 19.8,44.1 19.7,44.2 | 19.7,44.2 19.3,44.6 | 19.8,44.1 19.3,43.6 | 19.7,44.2 19.4,44.2 19.3,44.3 | 19.8,44.1 19.6,44.1 | 19.6,44.1 19.3,43.8 | v21.9,27.5 20.1,27.5 | 20.1,27.5 19.9,27.5 | 19.8,27.5 19.6,27.5 | 19.5,27.5 19.3,27.5 | 20.1,27.5 19.3,26.7 | 20.1,27.5 19.3,28.3 | 19.9,27.5 19.3,28.1 | 19.9,27.5 19.8,27.5 | 19.8,27.5 19.7,27.4 | 19.7,27.4 19.3,27 | 19.7,27.4 19.6,27.5 | 19.6,27.5 19.3,27.8 | 19.6,27.5 19.5,27.5 | 19.5,27.5 19.3,27.3 | 19.3,26.7 17.4,24.8 9.2,24.9 8.5,24.2 8.5,20.8 CN1.P$12
  Bottom 0.2: v27.7,45.91 27.93,47.04 IC5.P$2 | IC1.P$2 v27.8,62.2 | IC6.P$2 v27.6,28.9
HIN1  (via drill 0.35)
  Top 0.2: IC2.12 60.63,63.16 v60.6,63.2 | CN1.P$3 8.5,12.8 9.97,12.8 11.7,11.07 RA2.P$4
  Route3 0.2: v60.6,63.2 59.1,61.7 59.1,21.3 48.4,10.6 8.6,10.7 CN1.P$3
HIN2  (via drill 0.35)
  Top 0.2: IC3.12 61.84,46.66 v61.8,46.7 | CN1.P$5 7.9,13.8 8.9,14.8 11.3,14.8 12.47,13.62 RA1.P$2
  Route2 0.15: CN1.P$5 7.6,13.8 8.6,12.8 15.1,12.8 v19.1,8.8
  Route3 0.2: v61.8,46.7 60.7,46.7 60.1,46.1 60.1,20.7 47.5,8.1 19.8,8.1 v19.1,8.8
HIN3  (via drill 0.35)
  Top 0.2: IC4.12 62.46,30.17 v62.4,30.1 | CN1.P$7 8.5,16.8 11.6,16.8 13.03,15.38 RA1.P$4
  Route3 0.2: v62.4,30.1 61.7,30.1 61.1,29.5 61.1,20.1 47.9,6.9 19,6.9 v17.1,8.8
  Bottom 0.15: 13.8,14.8 17.1,11.5 v17.1,8.8
  Bottom 0.2: CN1.P$7 8.5,14.8 13.8,14.8
HO1
  Top 0.508: IC2.8 55.25,58.4 50.3,58.4 R1.P$2
HO2
  Top 0.508: IC3.8 55.25,41.9 50.8,41.9 50.6,41.9 50.3,41.9 R2.P$2
HO3
  Top 0.508: IC4.8 55.25,25.4 50.3,25.4 R3.P$2
LIN1  (via drill 0.35)
  Top 0.2: IC2.14 59.3,65.7 v58.6,65 | CN1.P$4 11.03,10.28 RA2.P$3
  Route3 0.2: v58.6,65 58.6,21.6 48.7,11.7 CN1.P$4
LIN2  (via drill 0.35)
  Top 0.2: IC3.14 v61.8,49.2 | CN1.P$6 11.3,13.8 12.28,12.82 RA1.P$1
  Route2 0.15: CN1.P$6 15.2,13.8 v20.1,8.9
  Route3 0.2: v61.8,49.2 60.1,49.2 59.6,48.7 59.6,21 47.5,8.9 v20.1,8.9
LIN3  (via drill 0.35)
  Top 0.2: IC4.14 v62.41,32.7 v62.4,32.7 | CN1.P$8 11.5,15.8 12.72,14.57 RA1.P$3
  Route3 0.2: v62.4,32.7 61.5,32.7 60.6,31.8 60.6,20.4 47.6,7.4 19.5,7.4 v18.1,8.8
  Bottom 0.15: 13.8,15.8 18.1,11.5 v18.1,8.8
  Bottom 0.2: CN1.P$8 13.8,15.8
LO1
  Top 0.508: R6.P$2 39.3,59.3 48.33,66.39 52.7,69.9 54.55,69.9 IC2.1
LO2
  Top 0.508: R5.P$2 40.9,42.8 45,45.8 49.5,50.3 49.5,52.2 50.4,53.1 54.85,53.1 IC3.1
LO3
  Top 0.508: R4.P$2 40.9,26.1 45,29.5 49.4,33.9 49.4,35.9 50.1,36.6 54.85,36.6 IC4.1
N$1
  Top 0.2: RA2.P$1 8.78,8.53 CN1.P$1
N$3  (2 unrouted)
  Bottom 0.889: FET2.S4 27.6,51.53 FET2.S8 | FET2.S7 FET2.S3 | FET2.S2 28.4,53.83 FET2.S6 | FET2.S5 26.7,54.98 FET2.S1
  Bottom 1.143: FD2.A arc-90 33.08,49 30.6,49 | 29.6,49 arc-103 27.6,51.53 | 30.6,49 29.6,49 | 30.6,49 arc-90 28.98,50.62 FET2.S4 FET2.S3 FET2.S2 FET2.S1 28.98,58.24 IC1.P$5 26.18,56.06 FET2.S5 | FET2.S8 arc90 28.71,49 29.6,49
  Bottom 2: 28.4,53.83 28.6,54.03 28.6,56.88 26.7,54.98
  Bottom 4: 27.6,54.3 27.6,51.53
N$5  (2 unrouted)
  Bottom 0.889: 28,38.47 FET4.S5 | FET4.S6 27.55,37.32 FET4.S2 | 27.5,36.17 FET4.S7 | FET4.S4 27.55,35.02 FET4.S8
  Bottom 1.143: FET4.S1 28,38.47 | 27.5,36.17 FET4.S3 | FET4.S1 FET4.S2 FET4.S3 | FET4.S3 FET4.S4 28.98,34.22 arc90 30.85,32.35 | FD4.A arc-90 32.94,32.35 30.85,32.35 | FET4.S8 arc90 28.85,32.35 30.22,32.35 | 30.85,32.35 30.22,32.35 | 30.22,32.35 arc-90 27.55,35.02 | FET4.S1 28.98,41.71 IC5.P$5 | IC5.P$5 26.5,40.06 26.5,39.4 | IC5.P$5 28.57,41.07 28.1,40.6
  Bottom 2: 28.5,38.97 28,38.47
  Bottom 4: 27.55,39 27.55,37.32 27.55,35.02
N$7  (via drill 0.35)  (1 unrouted)
  Top 0.2: v25.4,62.5 25.1,62.2 DC4.P$1
  Bottom 0.2: IC1.P$1 25.4,62.8 v25.4,62.5
N$8  (1 unrouted)
  Top 0.8: D1.K 81.81,8.8 81.83,8.82
  Top 1.016: 81.83,8.82 82.48,9.47 DC-DC1.P$3 82.48,14.72 | 82.48,14.72 82.48,15.82 81.3,17 79.5,17 | 82.48,14.72 82.05,15.15 | 82.05,15.15 81.1,16.1 80.6,16.1 79.3,16.1 | 82.05,15.15 79.25,15.15
  Top 3: 80.6,16.1 78.4,16.1 73.76,20.74 L1.P$1
N$9  (via drill 0.35)  (1 unrouted)
  Top 0.508: v31.6,59.3 R6.P$1
  Bottom 0.508: FET2.G 30.38,58.08 v31.6,59.3
N$10  (via drill 0.2)  (1 unrouted)
  Top 0.2: v25,46.01 24.09,46 DC5.P$1
  Bottom 0.2: IC5.P$1 25.3,46.38 v25,46.01
N$14  (via drill 0.35)  (1 unrouted)
  Top 0.508: v31.6,42.8 R5.P$1
  Bottom 0.508: FET4.G 30.38,41.58 v31.6,42.8
N$15  (2 unrouted)
  Bottom 0.889: FET6.S5 27.5,21.96 FET6.S1 | FET6.S6 FET6.S2 | FET6.S7 FET6.S3 | FET6.S8 26.9,18.52 27.5,18.52 FET6.S4
  Bottom 1.143: 28.47,25.02 28.98,25.01 FET6.S1 FET6.S2 FET6.S3 FET6.S4 28.98,17.92 arc90 31.1,15.8 | FET6.S5 26.18,23.03 28.47,25.02 | 28.47,25.02 28.57,24.17 27.4,23 | FD6.A arc-90 32.9,15.8 32.2,15.8 31.1,15.8 | FET6.S8 arc90 28.89,15.8 29.6,15.8 | 31.1,15.8 29.6,15.8 | 29.6,15.8 26.9,18.52
  Bottom 4: 27.5,18.52 27.5,21.96
N$16  (via drill 0.2)
  Top 0.2: v25,29.1 24.1,29.1 DC6.P$1
  Bottom 0.2: IC6.P$1 24.93,29.1 v25,29.1
N$17
  Top 0.61: 93.05,9.27 R7.P$2
  Top 0.813: DC-DC1.P$5 85.81,10.92
  Top 1: 85.74,11.93 DC-DC1.P$5
  Top 1.016: DC-DC1.P$5 85.88,9.92 86.6,9.2 88.86,9.2 R8.P$2 93.05,9.27
N$18  (via drill 0.35)  (1 unrouted)
  Top 0.508: v31.5,26.1 R4.P$1
  Bottom 0.508: FET6.G 30.38,25.08 v31.5,26.1
N$19  (via drill 0.35)  (1 unrouted)
  Top 0.508: v45.6,24.5 46.74,25.64 46.77,25.64 47.43,26.3 R3.P$1
  Bottom 0.508: FET5.G 45.62,24.58 v45.6,24.5
N$20  (via drill 0.35)  (1 unrouted)
  Top 0.508: v45.6,41 46.77,42.17 46.78,42.17 47.42,42.8 R2.P$1
  Bottom 0.508: FET3.G 45.62,41.08 v45.6,41
N$21  (via drill 0.35)  (1 unrouted)
  Top 0.508: v45.7,57.6 46.79,58.69 46.8,58.69 47.41,59.3 R1.P$1
  Bottom 0.508: FET1.G 45.62,57.52 v45.7,57.6
N$23
  Top 0.508: IC2.7 53.52,60.62 C8.P$1 53,60.1 FD7.K
N$25
  Top 0.508: IC3.7 53.52,44.12 C10.P$1 52.99,43.6 FD8.K
N$27
  Top 0.508: IC4.7 53.81,27.63 C12.P$1 53.29,27.1 FD9.K
N$28
  Top 0.508: DC2.P$1 IC3.11
N$29
  Top 0.508: DC3.P$1 IC4.11
N$30
  Top 0.508: DC1.P$1 IC2.11
N$31
  Top 1.016: PMC4.P$1 87.61,12.1 DC-DC1.P$6
SD  (via drill 0.35)
  Top 0.2: 11.2,9.8 CN1.P$2 12.9,9.8 RA2.P$2 13.58,9.32 14.2,8.7 14.2,8 14.71,7.49 34.39,7.49 35.9,9 v45.1,9
  Top 0.203: IC4.13 v63.66,31.43 v63.65,31.44 | IC3.13 v63.09,47.93 v63.08,47.94 | IC2.13 v62.2,64.44 v62.2,64.43
  Bottom 0.2: 59.34,64.44 58.1,63.2 58.1,46.9 | 58.1,46.9 58.1,30.5 | 58.1,30.5 58.1,22 v45.1,9 | 59.13,47.93 58.1,46.9 | 59.03,31.43 58.1,30.5
  Bottom 0.203: v63.65,31.44 59.04,31.44 59.03,31.43 | v63.08,47.94 59.14,47.94 59.13,47.93 | v62.2,64.43 59.34,64.43 59.34,64.44
VCC  (via drill 0.35)  (1 unrouted)
  Top 0.508: 79.9,12.3 80.13,12.07 DC-DC1.P$2 | C17.P$1 75.28,13.02 76,12.3
  Top 1.143: v38.87,50.73 arc-90 34.89,46.75 C4.P$1 | 38.87,34.11 v38.87,34.22 38.87,34 arc-90 C5.P$1 | v38.87,17.71 38.87,17.54 arc-90 C6.P$1
  Top 2: 60.65,12.3 CN3.P$1 60.28,12.12
  Top 3: CN3.P$1 76,12.3 79.9,12.3 | CN3.P$1 60.1,14.9 64.4,19.2 | 64.4,19.2 66.38,19.2 C16.P$1 68.88,19.16 | 68.88,19.16 C17.P$1 73.15,14.9 64.4,14.9 | CN3.P$1 64.1,16.3 70.1,16.3 | 68.88,19.16 64.44,19.16 64.4,19.2
  Route2 1.524: v38.87,17.71 v38.87,22.77 v38.87,34.22 v38.87,39.28 v38.87,50.73 v38.87,55.79
  Route2 2: FET1.D1 48.16,55.46 48.16,17.7 | 52,13.91 FET5.D3 51.7,12.3 | 52,13.91 53.61,12.3 | 53.61,12.3 CN3.P$1 | 48.6,12.3 43.7,12.3 40.9,16.98 39.59,16.98 v38.87,17.71 | 48.6,12.3 51.7,12.3 | 51.7,12.3 53.61,12.3 | 48.6,12.3 52,13.91
  Bottom 0.889: FD1.K 47.87,54.53 | FD3.K 47.87,38.02 | FD5.K 47.87,21.51
  Bottom 1.016: FET1.D6 v38.87,55.79 | FET3.D6 v38.87,39.28 | FET3.D4 v38.87,34.22 | FET5.D6 v38.87,22.77 | FET5.D4 v38.87,17.71
  Bottom 1.1: v38.87,50.73 FET1.D4
  Bottom 1.143: FET1.D6 FET1.D5 FET1.D4 | FET1.D2 FET1.D3 | FET1.D2 47.87,54.53 FET1.D1 | FET3.D6 FET3.D5 FET3.D4 | FET3.D2 FET3.D3 | FET3.D1 47.87,38.02 FET3.D2 | FET5.D6 FET5.D5 FET5.D4 | FET5.D2 FET5.D3 | FET5.D2 47.87,21.51 FET5.D1 | FET1.D3 46.5,51.06 | 46.5,51.06 PMC3.P$1 45.5,48.71 45.51,48.7 | FET3.D3 46.54,34.55 | FET5.D3 46.5,18.04 | 46.5,18.04 PMC1.P$1 45.52,15.69 45.53,15.7 | C1.P$1 arc-90 47.87,56.56 FET1.D1 | 47.87,39.05 FET3.D1 | C2.P$1 44.17,42.65 arc-90 FET3.D1 | C3.P$1 44.22,26.09 arc-90 FET5.D1 | FET5.D3 45.53,15.7 | 45.53,15.7 45,15.7 | 46.5,18.04 47.87,19.41 FET5.D2 | FET3.D3 45.52,32.2 | 45.52,32.2 45.05,32.2 | 46.54,34.55 PMC2.P$1 45.51,32.21 45.52,32.2 | 46.54,34.55 47.87,35.88 FET3.D2 | 46.5,51.06 47.87,52.43 FET1.D2 | FET1.D3 45.51,48.7 | 45.51,48.7 44.95,48.7 | FET3.D2 49.14,38.02 FD3.K 48.8,38.02 FET3.D1 | FET1.D1 48.8,54.53 FD1.K 49.14,54.53 FET1.D2 | FET5.D1 48.8,21.51 FD5.K 49.14,21.51 FET5.D2
  Bottom 1.524: v38.87,55.79 arc-90 42.69,59.61 C1.P$1 | C2.P$1 42.57,42.65 arc90 FET3.D6 | FET5.D6 arc-90 42.52,26.09 C3.P$1
  other vias: 47.87,53.26 47.87,55.46 47.87,51.06 47.87,22.44 47.87,20.24 47.87,18.04 47.87,34.55 47.87,36.75 47.87,38.95 44.15,48.71 44.2,32.21 44.15,15.69
VS1  (via drill 0.35)  (2 unrouted)
  Top 0.508: IC2.6 54.41,61.89 C8.P$2 53.4,63.9 v53.9,64.4
  Route3 0.508: v53.9,64.4 53.9,54.58 FD1.A
  Route3 0.813: FET1.S3 FET1.S4 | FET1.S3 v44.22,53.83 | v44.22,53.83 FET1.S1 42.8,54.98 | v44.22,53.83 v41.42,53.83 | FET1.S3 FET1.S7 | FET1.S4 42.8,51.53 | FET1.S5 42.8,54.98 | 42.8,54.98 42.8,53.26 42.8,51.53 | FET1.S8 42.8,51.53 | FD2.K 36.9,54.53 36.9,53.26 | FET1.S4 arc90 46.3,49.45 48.77,49.45 arc90 FD1.A
  Route3 1.143: FET2.D1 FET2.D2 FET2.D3 | FET2.D4 FET2.D5 FET2.D6
  Route3 3.5: CN2.P$2 16.3,57
  Route3 4: 42.8,53.2 42.8,53.26 36.9,53.26 FET2.D2 FET2.D5 23.57,53.2 20.1,53.2 16.3,57
  Bottom 0.889: FET1.S5 FET1.S1 | v41.42,53.83 v44.22,53.83 | FET1.S7 FET1.S3 | FET1.S8 FET1.S4
  Bottom 1.143: FET2.D1 FET2.D2 FET2.D3 | FET2.D6 FET2.D5 FET2.D4
  other vias: 23.63,53.26 44.22,54.98 44.22,52.68 44.22,51.53 41.42,54.98 41.42,52.68 41.42,51.53 35.46,54.53 23.63,55.46 23.63,51.06 32.63,51.06 32.63,53.26 32.63,55.46 50.7,51.38
VS2  (via drill 0.35)  (1 unrouted)
  Top 0.508: IC3.6 54.41,45.39 C10.P$2 53.4,47.5 v53.9,48
  Route3 0.508: v53.9,48 53.9,38.07 FD3.A
  Route3 0.813: v44.22,38.47 v44.22,37.32 FET3.S3 | FET3.S3 FET3.S4 | FET3.S8 FET3.S7 | FET3.S7 v41.42,37.32 v41.42,38.47 | FET3.S3 42.9,36.17 | FET3.S7 42.9,36.17 | 42.9,36.17 42.6,36.75 | 32.63,37.72 33.6,36.75 34.87,38.02 FD4.K
  Route3 0.889: FET3.S4 arc90 46.3,32.94 48.77,32.94 arc90 FD3.A
  Route3 1.143: FET4.D6 FET4.D5 FET4.D4 | FET4.D3 32.63,35.78 arc-90 33.6,36.75 arc-90 32.63,37.72 FET4.D1
  Route3 3.5: CN2.P$3 9.8,49.6
  Route3 4: 42.8,36.7 42.6,36.75 33.6,36.75 FET4.D2 FET4.D5 22.65,36.75 9.8,49.6
  Bottom 0.889: v41.42,38.47 v44.22,38.47 | v41.42,37.32 v44.22,37.32 | FET3.S7 FET3.S3 | FET3.S8 FET3.S4
  Bottom 1.143: FET4.D6 FET4.D5 FET4.D4 | FET4.D3 FET4.D2 FET4.D1
  other vias: 23.63,38.95 23.63,36.75 23.63,34.55 32.63,38.95 32.63,36.75 32.63,34.55 35.46,38.02 44.22,36.17 44.22,35.02 41.42,35.02 41.42,36.17 50.7,34.87
VS3  (via drill 0.35)  (2 unrouted)
  Top 0.508: IC4.6 54.41,28.89 C12.P$2 53.55,30.95 v53.9,31.3
  Route3 0.508: v53.9,31.3 53.9,21.56 FD5.A
  Route3 0.889: v41.42,19.66 FET5.S6 42.8,20.82 | v41.42,19.66 FET5.S8 42.8,18.52 | 42.8,18.52 FET5.S4 arc90 46.3,16.43 48.77,16.43 arc90 FD5.A | 42.8,19.66 42.8,18.52 | FET5.S2 42.8,20.82 | v44.22,19.66 42.8,19.66 | 42.8,19.66 42.8,20.24 42.8,20.82 | v41.42,19.66 42.8,19.66 | FD6.K 35.4,21.51 35.4,20.24 FET6.D2 | FET6.D1 FET6.D2 | FET6.D3 FET6.D2
  Route3 1.143: FET6.D6 23.6,22.44 23.6,21.8 | FET6.D4 23.6,18.04 23.6,19.1
  Route3 3.5: CN2.P$1 8.6,57 5.1,53.5
  Route3 4: 42.8,20.2 42.8,20.24 35.4,20.24 FET6.D5 17.5,26.37 17.5,34.6 5.1,47 5.1,53.5
  Bottom 0.889: v41.42,21.96 v44.22,21.96 | FET5.S6 FET5.S2 | v44.22,19.66 v41.42,19.66 | FET5.S8 FET5.S4
  Bottom 1.143: FET6.D6 FET6.D5 FET6.D4 | FET6.D3 FET6.D2 FET6.D1
  other vias: 23.63,22.44 23.63,20.24 23.63,18.04 32.63,22.44 32.63,20.24 32.63,18.04 35.46,21.51 44.22,20.82 41.42,20.82 44.22,18.52 41.42,18.52 50.7,18.36

### Text on the board
tPlace: It's First version functionally test board / Have a possibility of a undiscovered fatal malfunction | CAUTION | +20V Output
bPlace: It's First version functionally test board / Have a possibility of a undiscovered fatal malfunction | CAUTION